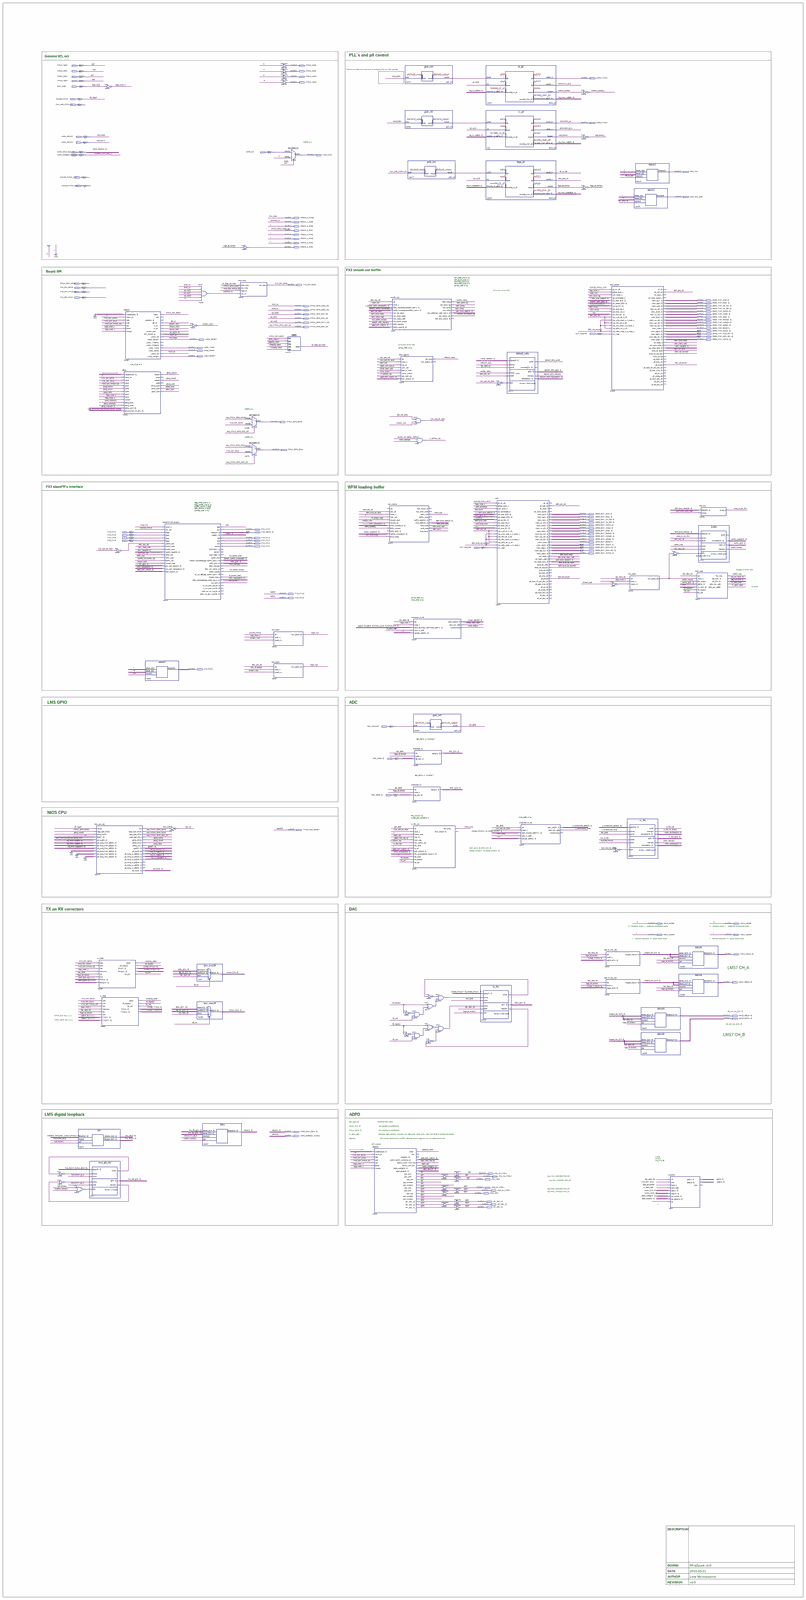
[diagram p0: schematic sheet, whole]
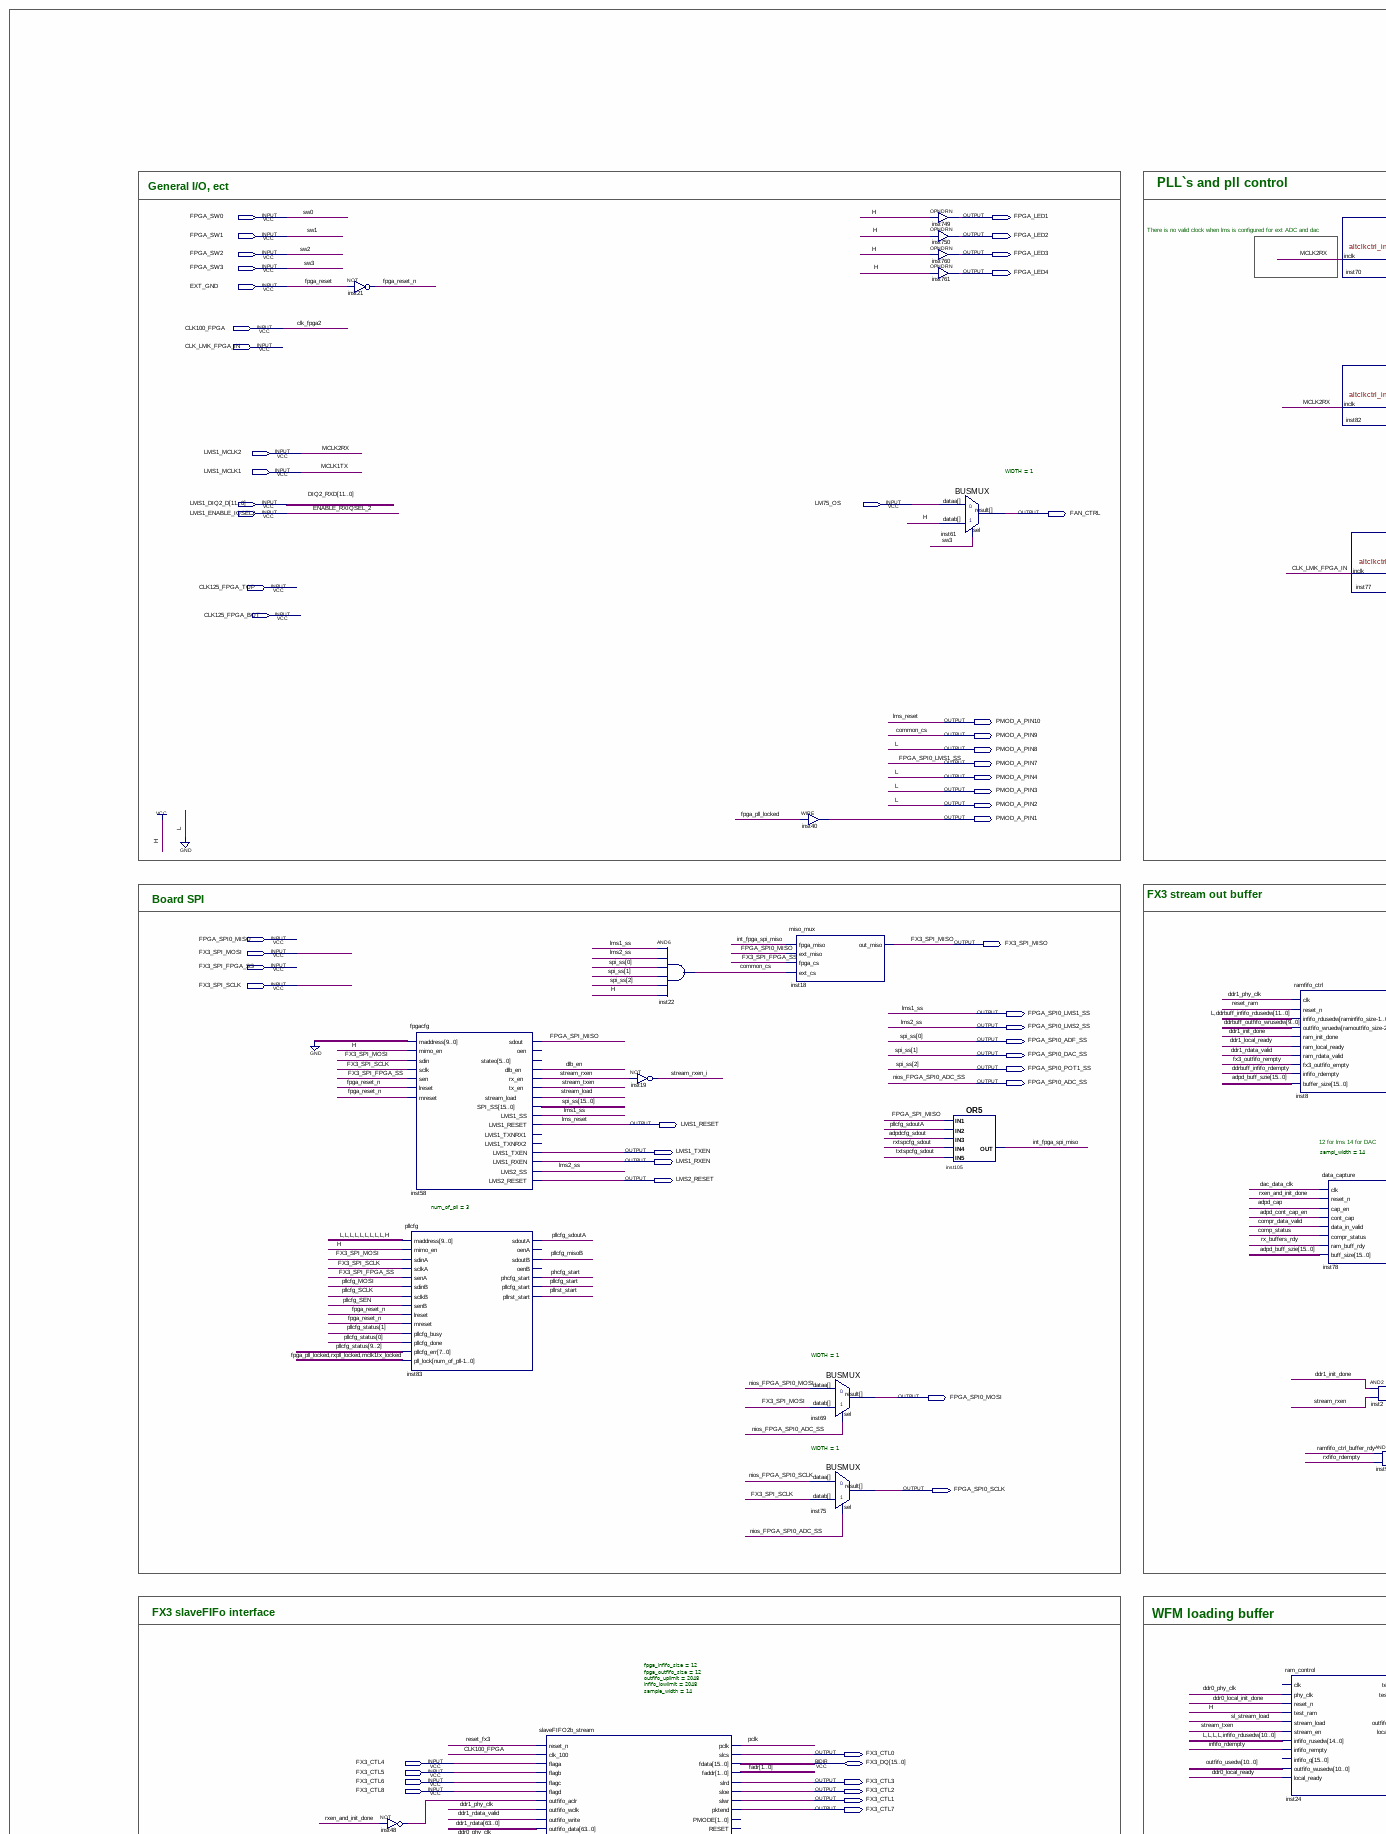
[diagram p1: schematic sheet, upper left part]
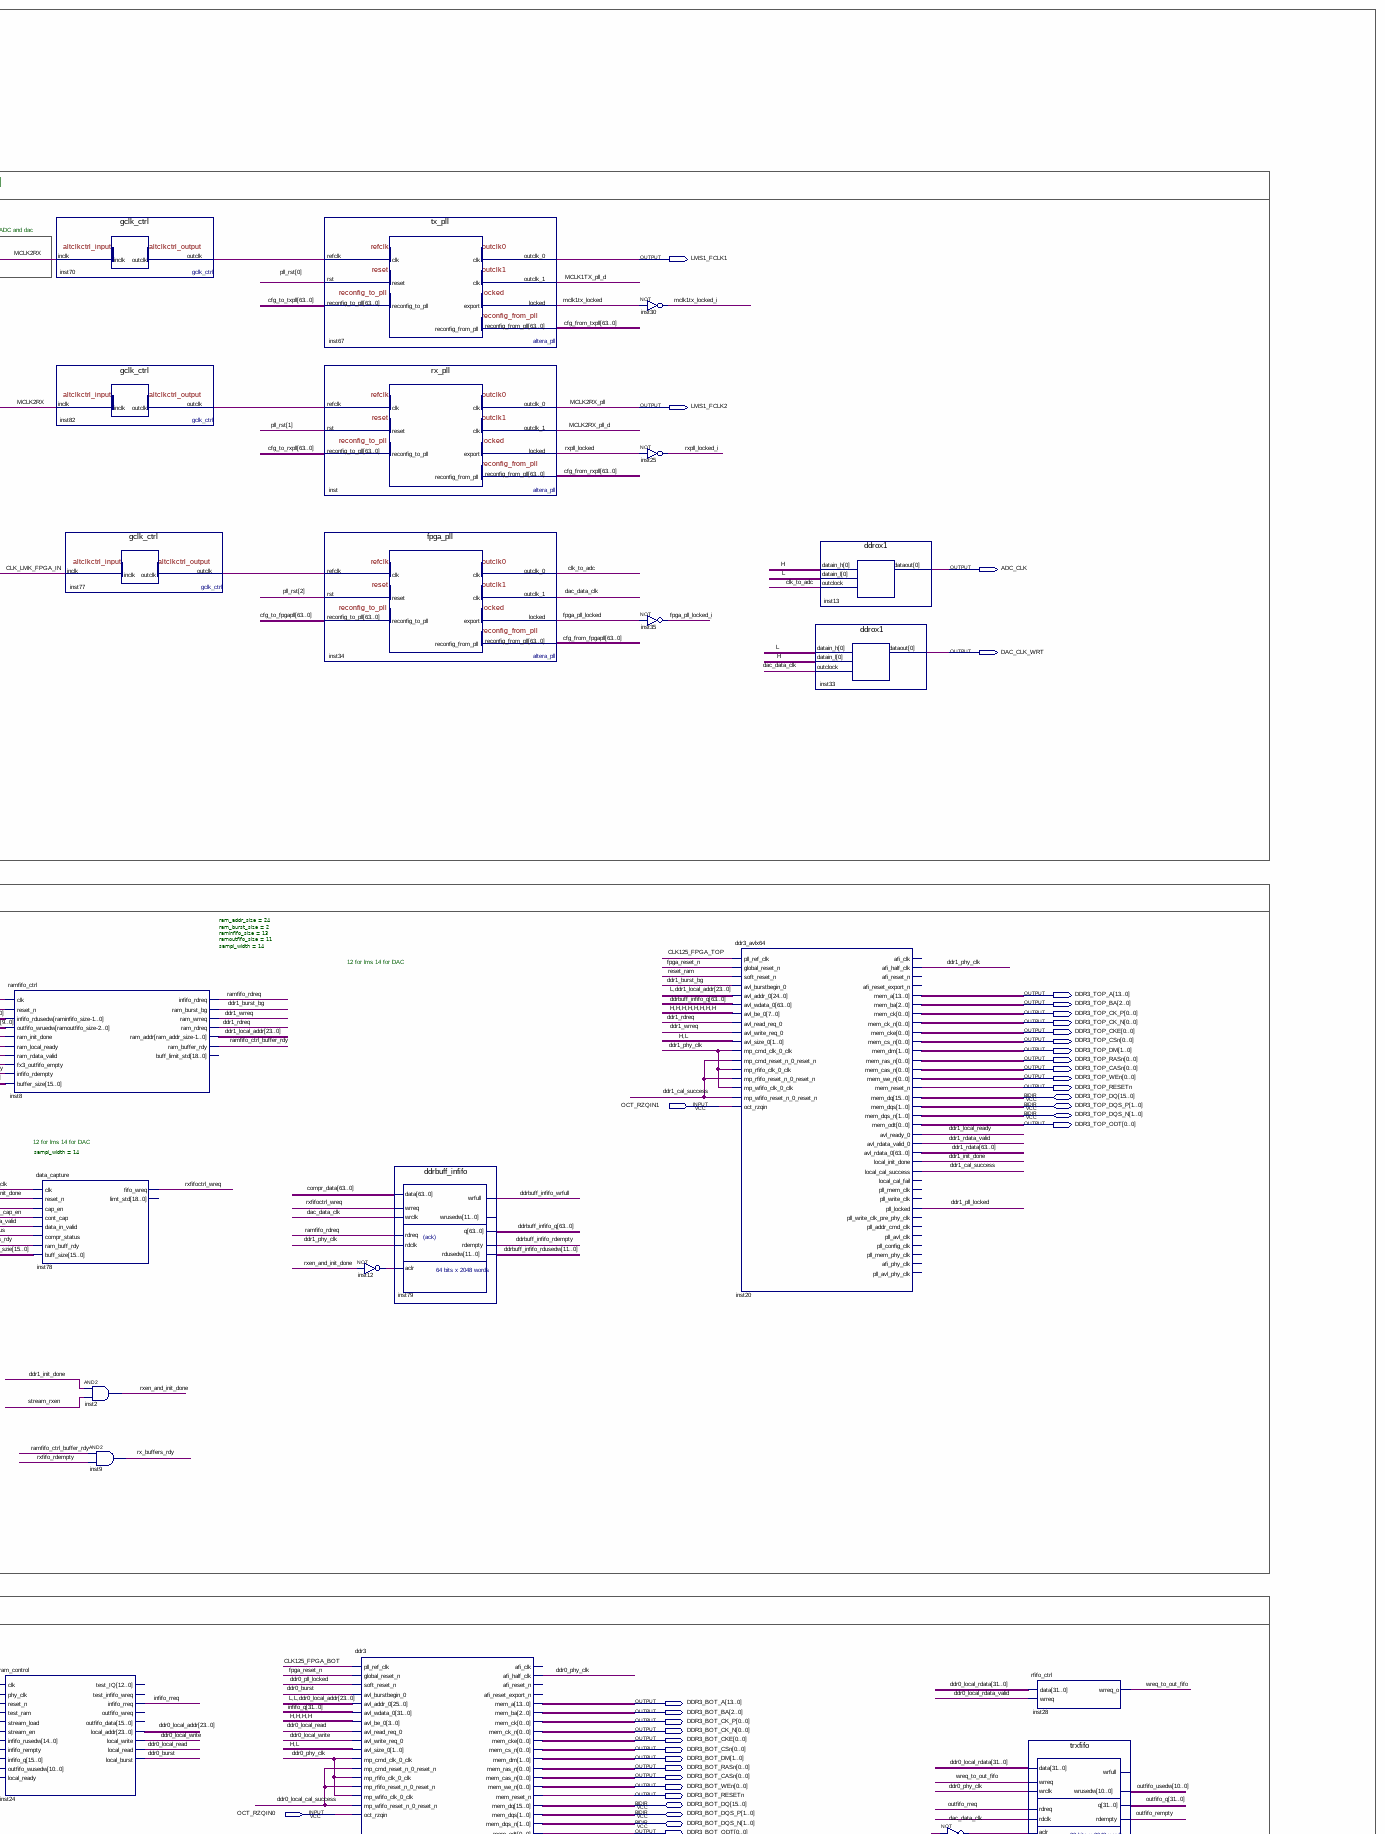
[diagram p2: schematic sheet, upper right part]
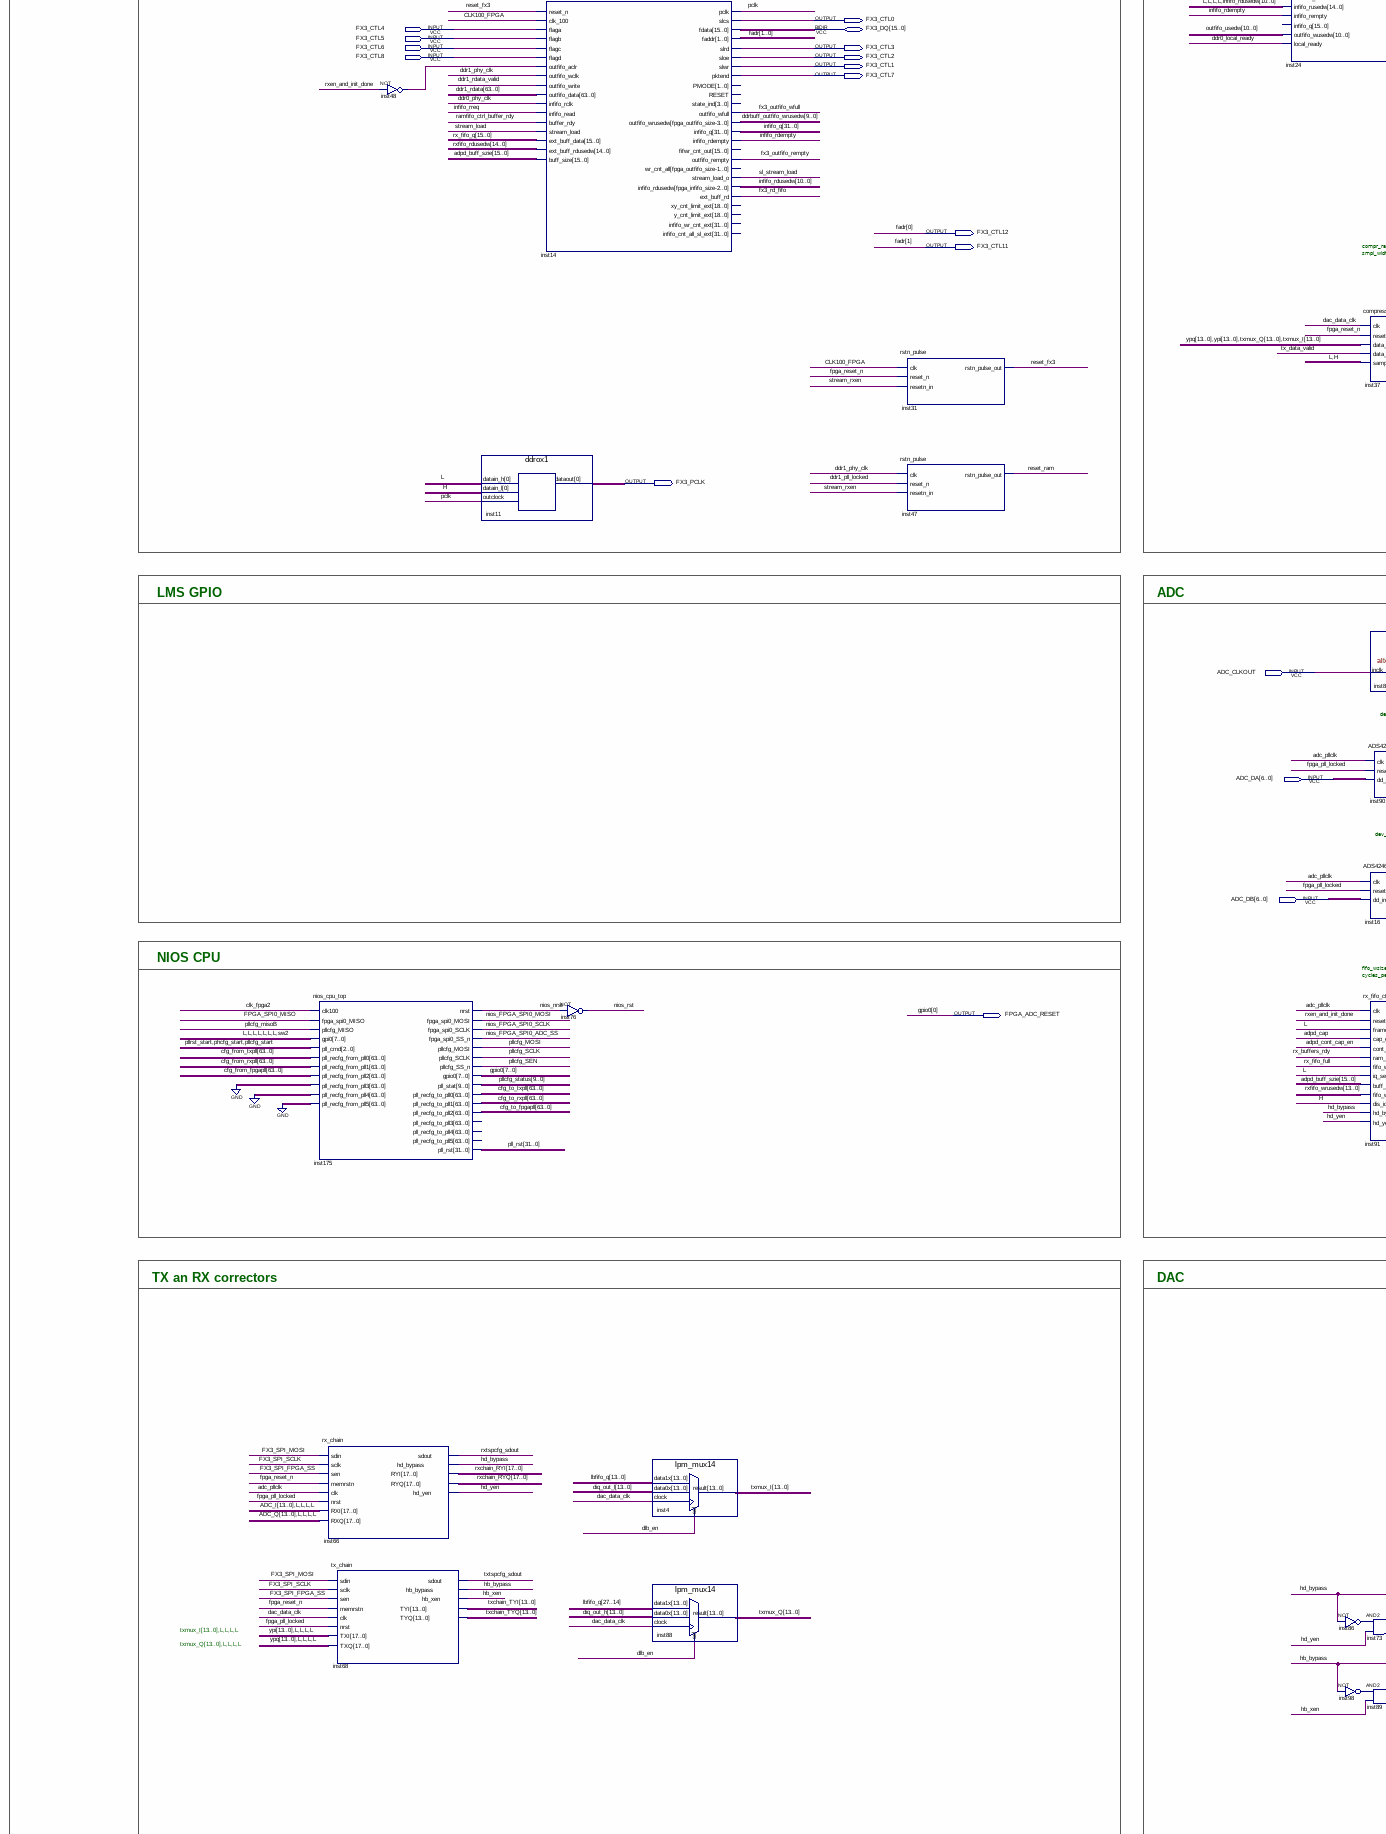
[diagram p3: schematic sheet, middle left part]
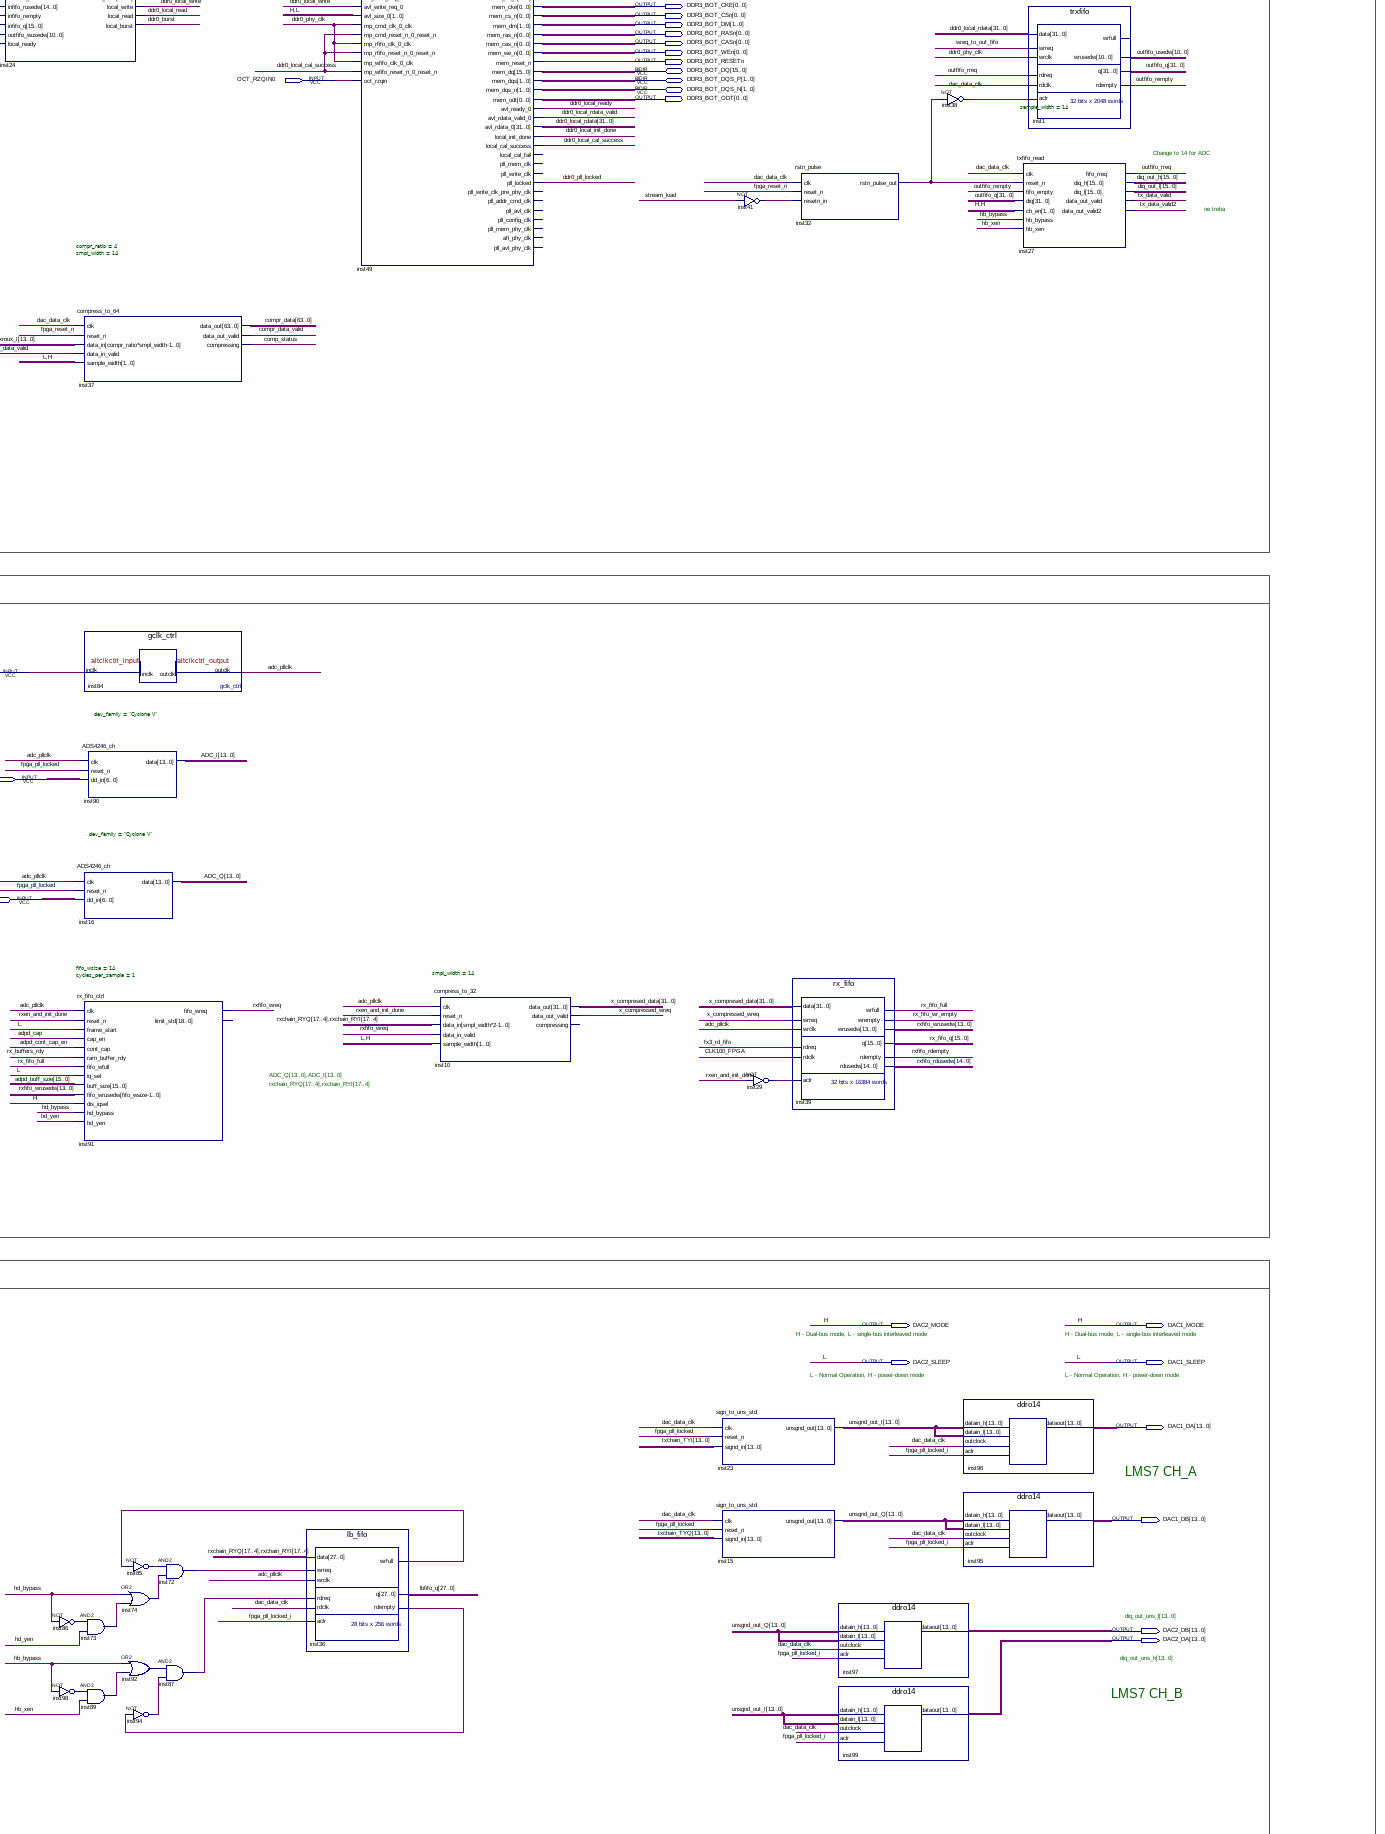
[diagram p4: schematic sheet, middle right part]
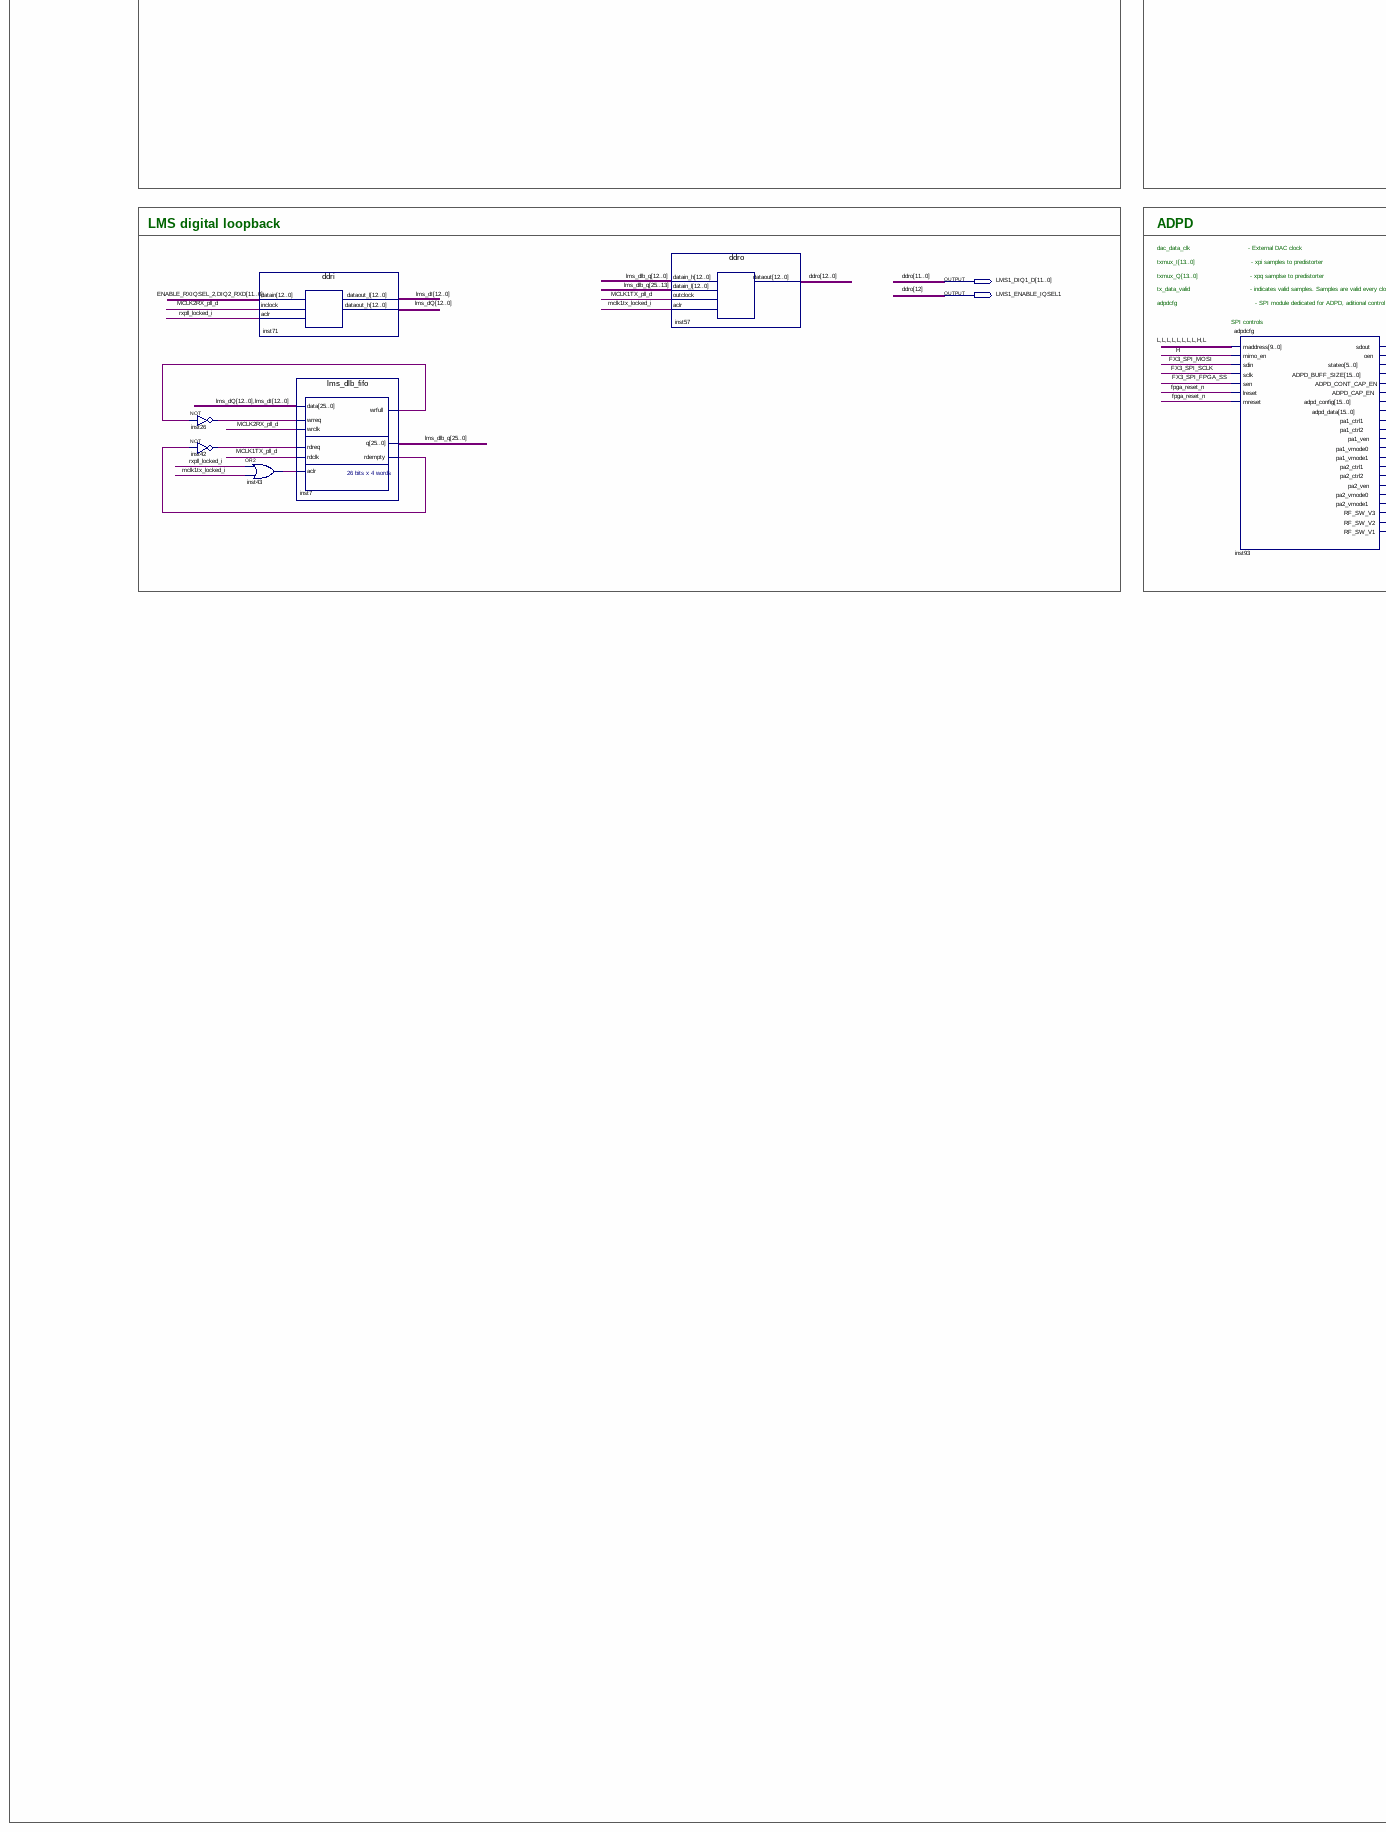
[diagram p5: schematic sheet, lower left part]
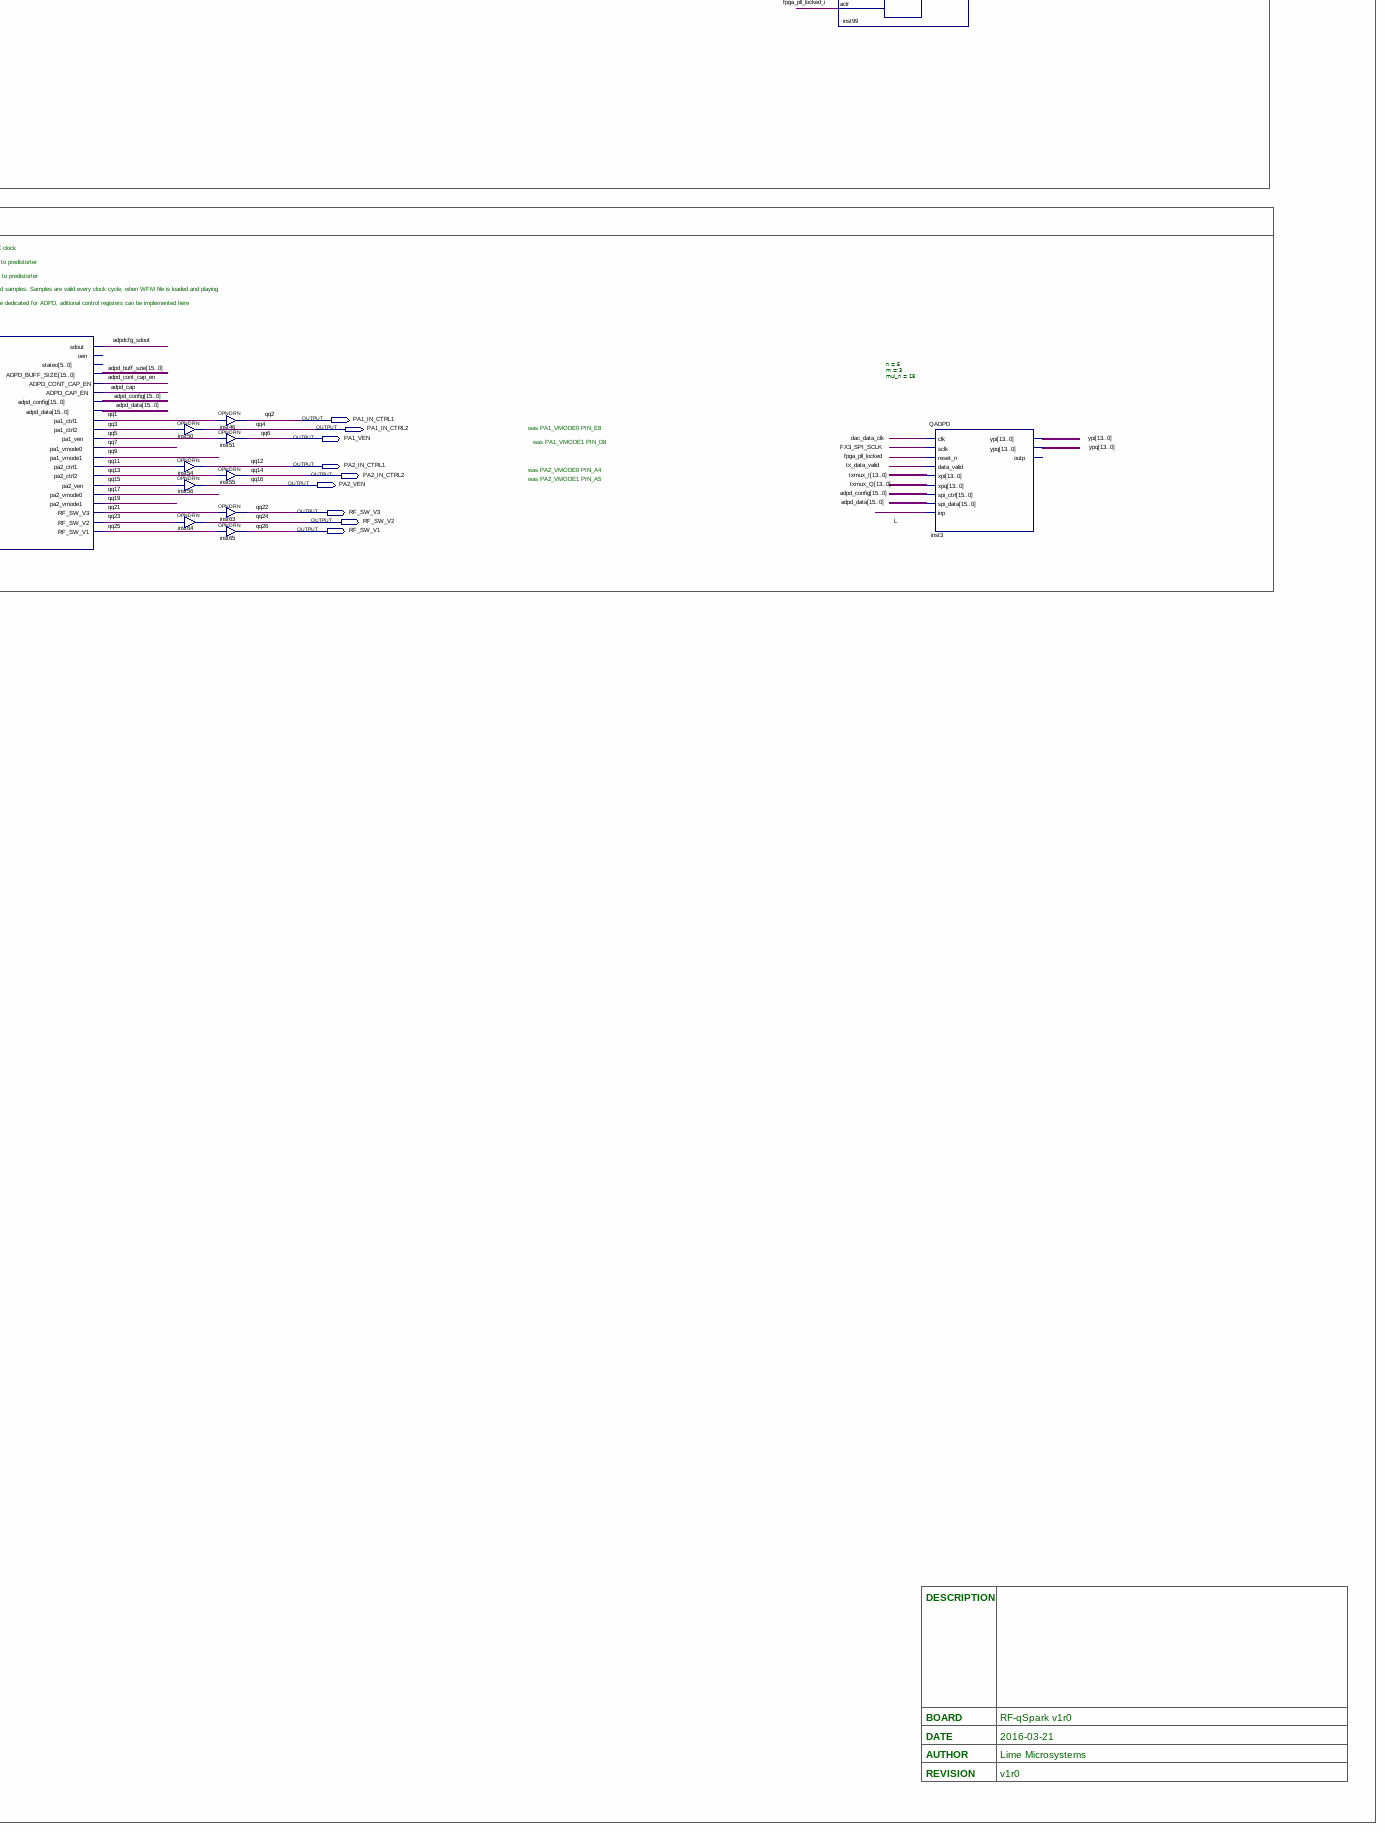
[diagram p6: schematic sheet, lower right part]
// Quartus schematic lms7_ADPD_top.bdf as structural Verilog: 94 symbols, 116 pins
module lms7_ADPD_top (
  input  FPGA_SW0,
  input  FPGA_SW1,
  input  FPGA_SW2,
  input  FPGA_SW3,
  input  EXT_GND,
  input  CLK100_FPGA,
  input  CLK_LMK_FPGA_IN,
  input  LMS1_MCLK2,
  input  LMS1_MCLK1,
  input  [11:0] LMS1_DIQ2_D,
  input  LM75_OS,
  input  LMS1_ENABLE_IQSEL2,
  input  CLK125_FPGA_TOP,
  input  CLK125_FPGA_BOT,
  input  FPGA_SPI0_MISO,
  input  FX3_SPI_MOSI,
  input  FX3_SPI_FPGA_SS,
  input  FX3_SPI_SCLK,
  input  OCT_RZQIN1,
  input  FX3_CTL4,
  input  FX3_CTL5,
  input  FX3_CTL6,
  input  FX3_CTL8,
  input  OCT_RZQIN0,
  input  ADC_CLKOUT,
  input  [6:0] ADC_DA,
  input  [6:0] ADC_DB,
  inout  [15:0] DDR3_TOP_DQ,
  inout  [1:0] DDR3_TOP_DQS_P,
  inout  [1:0] DDR3_TOP_DQS_N,
  inout  [15:0] FX3_DQ,
  inout  [15:0] DDR3_BOT_DQ,
  inout  [1:0] DDR3_BOT_DQS_P,
  inout  [1:0] DDR3_BOT_DQS_N,
  output FPGA_LED1,
  output FPGA_LED2,
  output FPGA_LED3,
  output LMS1_FCLK1,
  output FPGA_LED4,
  output LMS1_FCLK2,
  output FAN_CTRL,
  output ADC_CLK,
  output DAC_CLK_WRT,
  output PMOD_A_PIN10,
  output PMOD_A_PIN9,
  output PMOD_A_PIN8,
  output PMOD_A_PIN7,
  output PMOD_A_PIN4,
  output PMOD_A_PIN3,
  output PMOD_A_PIN2,
  output PMOD_A_PIN1,
  output FX3_SPI_MISO,
  output [13:0] DDR3_TOP_A,
  output [2:0] DDR3_TOP_BA,
  output FPGA_SPI0_LMS1_SS,
  output [0:0] DDR3_TOP_CK_P,
  output [0:0] DDR3_TOP_CK_N,
  output FPGA_SPI0_LMS2_SS,
  output [0:0] DDR3_TOP_CKE,
  output FPGA_SPI0_ADF_SS,
  output [0:0] DDR3_TOP_CSn,
  output [1:0] DDR3_TOP_DM,
  output FPGA_SPI0_DAC_SS,
  output [0:0] DDR3_TOP_RASn,
  output FPGA_SPI0_POT1_SS,
  output [0:0] DDR3_TOP_CASn,
  output [0:0] DDR3_TOP_WEn,
  output FPGA_SPI0_ADC_SS,
  output DDR3_TOP_RESETn,
  output LMS1_RESET,
  output [0:0] DDR3_TOP_ODT,
  output LMS1_TXEN,
  output LMS1_RXEN,
  output LMS2_RESET,
  output FPGA_SPI0_MOSI,
  output FPGA_SPI0_SCLK,
  output [13:0] DDR3_BOT_A,
  output [2:0] DDR3_BOT_BA,
  output [0:0] DDR3_BOT_CK_P,
  output [0:0] DDR3_BOT_CK_N,
  output [0:0] DDR3_BOT_CKE,
  output [0:0] DDR3_BOT_CSn,
  output FX3_CTL0,
  output [1:0] DDR3_BOT_DM,
  output [0:0] DDR3_BOT_RASn,
  output [0:0] DDR3_BOT_CASn,
  output FX3_CTL3,
  output [0:0] DDR3_BOT_WEn,
  output FX3_CTL2,
  output DDR3_BOT_RESETn,
  output FX3_CTL1,
  output FX3_CTL7,
  output [0:0] DDR3_BOT_ODT,
  output FX3_CTL12,
  output FX3_CTL11,
  output FX3_PCLK,
  output FPGA_ADC_RESET,
  output DAC2_MODE,
  output DAC1_MODE,
  output DAC2_SLEEP,
  output DAC1_SLEEP,
  output [13:0] DAC1_DA,
  output [13:0] DAC1_DB,
  output [13:0] DAC2_DB,
  output [13:0] DAC2_DA,
  output [11:0] LMS1_DIQ1_D,
  output LMS1_ENABLE_IQSEL1,
  output PA1_IN_CTRL1,
  output PA1_IN_CTRL2,
  output PA1_VEN,
  output PA2_IN_CTRL1,
  output PA2_IN_CTRL2,
  output PA2_VEN,
  output RF_SW_V3,
  output RF_SW_V2,
  output RF_SW_V1
);

  wire adc_pllclk, adpd_cap, adpd_cont_cap_en, adpdcfg_sdout, clk_to_adc, comp_status, compr_data_valid,
       dac_data_clk, ddr0_burst, ddr0_local_cal_success, ddr0_local_init_done, ddr0_local_rdata_valid,
       ddr0_local_read, ddr0_local_ready, ddr0_local_write, ddr0_phy_clk, ddr0_pll_locked, ddr1_burst_bg,
       ddr1_cal_success, ddr1_init_done, ddr1_local_ready, ddr1_phy_clk, ddr1_pll_locked, ddr1_rdata_valid,
       ddr1_rdreq, ddr1_wrreq, ddrbuff_infifo_rdempty, ddrbuff_infifo_wrfull, dlb_en, fpga_pll_locked,
       fpga_pll_locked_i, fpga_reset_n, FPGA_SPI_MISO, fx3_outfifo_rempty, fx3_outfifo_wfull, fx3_rd_fifo,
       hb_bypass, hb_xen, hd_bypass, hd_yen, infifo_rdempty, infifo_rreq, inst7_rdempty, inst7_wrfull,
       inst12_out, inst26_out, inst29_out, inst32_rstn_pulse_out, inst36_rdempty, inst36_wrfull, inst38_out,
       inst41_out, inst42_out, inst43_out, inst48_out, inst70_outclk, inst72_out, inst73_out, inst74_out,
       inst77_outclk, inst82_outclk, inst85_out, inst86_out, inst87_out, inst89_out, inst92_out, inst94_out,
       inst98_out, int_fpga_spi_miso, mclk1tx_locked, mclk1tx_locked_i, MCLK1TX_pll_d, MCLK2RX_pll_d,
       nios_FPGA_SPI0_MOSI, nios_FPGA_SPI0_SCLK, nios_nrst, nios_rst, outfifo_rempty, outfifo_rreq, pclk,
       phcfg_start, pllcfg_misoB, pllcfg_MOSI, pllcfg_SCLK, pllcfg_sdoutA, pllcfg_SEN, pllcfg_start,
       pllrst_start, qq1, qq3, qq5, qq7, qq9, qq11, qq13, qq15, qq17, qq19, qq21, qq23, qq25,
       ramfifo_ctrl_buffer_rdy, ramfifo_rdreq, reset_fx3, reset_ram, rx_buffers_rdy, rx_fifo_full,
       rx_fifo_wr_empty, rxen_and_init_done, rxfifo_rdempty, rxfifo_wreq, rxfifoctrl_wreq, rxpll_locked,
       rxpll_locked_i, rxtspcfg_sdout, sl_stream_load, stream_load, stream_rxen, stream_rxen_i, stream_txen,
       tx_data_valid, tx_data_valid2, txtspcfg_sdout, wreq_to_out_fifo, x_compressed_wreq;
  wire [7:1] gpio0;
  wire [9:0] ddrbuff_outfifo_wrusedw, pllcfg_status;
  wire [10:0] infifo_rdusedw, outfifo_usedw;
  wire [11:0] ddrbuff_infifo_rdusedw;
  wire [12:0] lms_dI, lms_dQ;
  wire [13:0] ADC_I, ADC_Q, rxfifo_wrusedw, txchain_TYI, txchain_TYQ, txmux_I, txmux_Q, unsgnd_out_I,
       unsgnd_out_Q, ypi, ypq;
  wire [14:0] rxfifo_rdusedw;
  wire [15:0] adpd_buff_szie, adpd_config, adpd_data, diq_out_h, diq_out_l, rx_fifo_q;
  wire [15:3] spi_ss;
  wire [17:0] rxchain_RYI, rxchain_RYQ;
  wire [23:0] ddr0_local_addr, ddr1_local_addr;
  wire [25:0] lms_dlb_q;
  wire [27:0] lbfifo_q;
  wire [31:0] ddr0_local_rdata, infifo_q, outfifo_q, pll_rst, x_compresed_data;
  wire [63:0] cfg_from_fpgapll, cfg_from_rxpll, cfg_from_txpll, cfg_to_fpgapll, cfg_to_rxpll, cfg_to_txpll,
       compr_data, ddr1_rdata, ddrbuff_infifo_q;

  not inst26 (inst26_out, inst7_wrfull);
  not inst42 (inst42_out, inst7_rdempty);
  or inst43 (inst43_out, rxpll_locked_i, mclk1tx_locked_i);
  ddri inst71 (
    .datain({LMS1_ENABLE_IQSEL2, LMS1_DIQ2_D}), .inclock(MCLK2RX_pll_d), .aclr(rxpll_locked_i),
    .dataout_l(lms_dI), .dataout_h(lms_dQ));
  nios_cpu_top inst175 (
    .clk100(CLK100_FPGA), .fpga_spi0_MISO(FPGA_SPI0_MISO), .pllcfg_MISO(pllcfg_misoB),
    .gpi0({{7{1'b0}}, FPGA_SW2}), .pll_cmd({pllrst_start, phcfg_start, pllcfg_start}),
    .pll_recfg_from_pll0(cfg_from_txpll), .pll_recfg_from_pll1(cfg_from_rxpll),
    .pll_recfg_from_pll2(cfg_from_fpgapll), .pll_recfg_from_pll3({64{1'b0}}),
    .pll_recfg_from_pll4({64{1'b0}}), .pll_recfg_from_pll5({64{1'b0}}), .nrst(nios_nrst),
    .fpga_spi0_MOSI(nios_FPGA_SPI0_MOSI), .fpga_spi0_SCLK(nios_FPGA_SPI0_SCLK),
    .fpga_spi0_SS_n(FPGA_SPI0_ADC_SS), .pllcfg_MOSI(pllcfg_MOSI), .pllcfg_SCLK(pllcfg_SCLK),
    .pllcfg_SS_n(pllcfg_SEN), .gpio0({gpio0, FPGA_ADC_RESET}), .pll_stat(pllcfg_status),
    .pll_recfg_to_pll0(cfg_to_txpll), .pll_recfg_to_pll1(cfg_to_rxpll), .pll_recfg_to_pll2(cfg_to_fpgapll),
    .pll_rst(pll_rst));  // open: pll_recfg_to_pll3, pll_recfg_to_pll4, pll_recfg_to_pll5
  rx_chain inst66 (
    .sdin(FX3_SPI_MOSI), .sclk(FX3_SPI_SCLK), .sen(FX3_SPI_FPGA_SS), .memrstn(fpga_reset_n),
    .clk(adc_pllclk), .nrst(fpga_pll_locked), .RXI({ADC_I, 4'b0000}), .RXQ({ADC_Q, 4'b0000}),
    .sdout(rxtspcfg_sdout), .hd_bypass(hd_bypass), .RYI(rxchain_RYI), .RYQ(rxchain_RYQ), .hd_yen(hd_yen));
  lms_dlb_fifo inst7 (
    .data({lms_dQ, lms_dI}), .wrreq(inst26_out), .wrclk(MCLK2RX_pll_d), .rdreq(inst42_out),
    .rdclk(MCLK1TX_pll_d), .aclr(inst43_out), .wrfull(inst7_wrfull), .q(lms_dlb_q), .rdempty(inst7_rdempty));
  not inst21 (fpga_reset_n, EXT_GND);
  tx_chain inst68 (
    .sdin(FX3_SPI_MOSI), .sclk(FX3_SPI_SCLK), .sen(FX3_SPI_FPGA_SS), .memrstn(fpga_reset_n),
    .clk(dac_data_clk), .nrst(fpga_pll_locked), .TXI({ypi, 4'b0000}), .TXQ({ypq, 4'b0000}),
    .sdout(txtspcfg_sdout), .hb_bypass(hb_bypass), .hb_xen(hb_xen), .TYI(txchain_TYI), .TYQ(txchain_TYQ));
  not inst48 (inst48_out, rxen_and_init_done);
  fpgacfg inst58 (
    .maddress({10{1'b0}}), .mimo_en(1'b1), .sdin(FX3_SPI_MOSI), .sclk(FX3_SPI_SCLK), .sen(FX3_SPI_FPGA_SS),
    .lreset(fpga_reset_n), .mreset(fpga_reset_n), .sdout(FPGA_SPI_MISO), .dlb_en(dlb_en),
    .rx_en(stream_rxen), .tx_en(stream_txen), .stream_load(stream_load),
    .SPI_SS({spi_ss, FPGA_SPI0_POT1_SS, FPGA_SPI0_DAC_SS, FPGA_SPI0_ADF_SS}), .LMS1_SS(FPGA_SPI0_LMS1_SS),
    .LMS1_RESET(LMS1_RESET), .LMS1_TXEN(LMS1_TXEN), .LMS1_RXEN(LMS1_RXEN), .LMS2_SS(FPGA_SPI0_LMS2_SS),
    .LMS2_RESET(LMS2_RESET));  // open: oen, stateo, LMS1_TXNRX1, LMS1_TXNRX2
  pllcfg #(.num_of_pll(3)) inst83 (
    .maddress(10'b0000000001), .mimo_en(1'b1), .sdinA(FX3_SPI_MOSI), .sclkA(FX3_SPI_SCLK),
    .senA(FX3_SPI_FPGA_SS), .sdinB(pllcfg_MOSI), .sclkB(pllcfg_SCLK), .senB(pllcfg_SEN),
    .lreset(fpga_reset_n), .mreset(fpga_reset_n), .pllcfg_busy(pllcfg_status[1]),
    .pllcfg_done(pllcfg_status[0]), .pllcfg_err(pllcfg_status[9:2]),
    .pll_lock({fpga_pll_locked, rxpll_locked, mclk1tx_locked}), .sdoutA(pllcfg_sdoutA),
    .sdoutB(pllcfg_misoB), .phcfg_start(phcfg_start), .pllcfg_start(pllcfg_start), .pllrst_start(pllrst_start));  // open: oenA, oenB
  ddrox1 inst11 (.datain_h(1'b0), .datain_l(1'b1), .outclock(pclk), .dataout(FX3_PCLK));
  slaveFIFO2b_stream #(.fpga_infifo_size(12), .fpga_outfifo_size(12), .outfifo_uplimit(2048), .infifo_lowlimit(2048), .sample_width(14)) inst14 (
    .reset_n(reset_fx3), .clk_100(CLK100_FPGA), .flaga(FX3_CTL4), .flagb(FX3_CTL5), .flagc(FX3_CTL6),
    .flagd(FX3_CTL8), .outfifo_aclr(inst48_out), .outfifo_wclk(ddr1_phy_clk),
    .outfifo_write(ddr1_rdata_valid), .outfifo_data(ddr1_rdata), .infifo_rclk(ddr0_phy_clk),
    .infifo_read(infifo_rreq), .buffer_rdy(ramfifo_ctrl_buffer_rdy), .stream_load(stream_load),
    .ext_buff_data(rx_fifo_q), .ext_buff_rdusedw(rxfifo_rdusedw), .buff_size(adpd_buff_szie), .pclk(pclk),
    .slcs(FX3_CTL0), .faddr({FX3_CTL11, FX3_CTL12}), .slrd(FX3_CTL3), .sloe(FX3_CTL2), .slwr(FX3_CTL1),
    .pktend(FX3_CTL7), .outfifo_wfull(fx3_outfifo_wfull), .outfifo_wrusedw(ddrbuff_outfifo_wrusedw),
    .infifo_q(infifo_q), .infifo_rdempty(infifo_rdempty), .outfifo_rempty(fx3_outfifo_rempty),
    .stream_load_o(sl_stream_load), .infifo_rdusedw(infifo_rdusedw), .ext_buff_rd(fx3_rd_fifo), .fdata(FX3_DQ));  // open: PMODE, RESET, state_ind, fifwr_cnt_out, wr_cnt_all, xy_cnt_limit_ext, y_cnt_limit_ext, infifo_wr_cnt_ext, infifo_cnt_all_sl_ext
  not inst76 (nios_rst, nios_nrst);
  and inst22 (PMOD_A_PIN9, FPGA_SPI0_LMS1_SS, FPGA_SPI0_LMS2_SS, FPGA_SPI0_ADF_SS, FPGA_SPI0_DAC_SS, FPGA_SPI0_POT1_SS, 1'b1);
  not inst19 (stream_rxen_i, stream_rxen);
  lpm_mux14 inst4 (
    .data1x(lbfifo_q[13:0]), .data0x(diq_out_l[13:0]), .clock(dac_data_clk), .sel(dlb_en), .result(txmux_I));
  lpm_mux14 inst88 (
    .data1x(lbfifo_q[27:14]), .data0x(diq_out_h[13:0]), .clock(dac_data_clk), .sel(dlb_en), .result(txmux_Q));
  ddro inst57 (
    .datain_h(lms_dlb_q[12:0]), .datain_l(lms_dlb_q[25:13]), .outclock(MCLK1TX_pll_d),
    .aclr(mclk1tx_locked_i), .dataout({LMS1_ENABLE_IQSEL1, LMS1_DIQ1_D}));
  assign PMOD_A_PIN1 = fpga_pll_locked;  // WIRE inst40
  miso_mux inst18 (
    .fpga_miso(int_fpga_spi_miso), .ext_miso(FPGA_SPI0_MISO), .fpga_cs(FX3_SPI_FPGA_SS),
    .ext_cs(PMOD_A_PIN9), .out_miso(FX3_SPI_MISO));
  BUSMUX #(.WIDTH(1)) inst69 (
    .datab(FX3_SPI_MOSI), .sel(FPGA_SPI0_ADC_SS), .dataa(nios_FPGA_SPI0_MOSI), .result(FPGA_SPI0_MOSI));
  BUSMUX #(.WIDTH(1)) inst75 (
    .datab(FX3_SPI_SCLK), .sel(FPGA_SPI0_ADC_SS), .dataa(nios_FPGA_SPI0_SCLK), .result(FPGA_SPI0_SCLK));
  rstn_pulse inst31 (.clk(CLK100_FPGA), .reset_n(fpga_reset_n), .resetn_in(stream_rxen), .rstn_pulse_out(reset_fx3));
  rstn_pulse inst47 (
    .clk(ddr1_phy_clk), .reset_n(ddr1_pll_locked), .resetn_in(stream_rxen), .rstn_pulse_out(reset_ram));
  OPNDRN inst749 (.IN(1'b1), .OUT(FPGA_LED1));
  OPNDRN inst750 (.IN(1'b1), .OUT(FPGA_LED2));
  OPNDRN inst760 (.IN(1'b1), .OUT(FPGA_LED3));
  OPNDRN inst761 (.IN(1'b1), .OUT(FPGA_LED4));
  BUSMUX #(.WIDTH(1)) inst61 (.datab(1'b1), .sel(FPGA_SW3), .dataa(LM75_OS), .result(FAN_CTRL));
  or inst105 (int_fpga_spi_miso, FPGA_SPI_MISO, pllcfg_sdoutA, adpdcfg_sdout, rxtspcfg_sdout, txtspcfg_sdout);
  adpdcfg inst93 (
    .maddress(10'b0000000010), .mimo_en(1'b1), .sdin(FX3_SPI_MOSI), .sclk(FX3_SPI_SCLK),
    .sen(FX3_SPI_FPGA_SS), .lreset(fpga_reset_n), .mreset(fpga_reset_n), .sdout(adpdcfg_sdout),
    .ADPD_BUFF_SIZE(adpd_buff_szie), .ADPD_CONT_CAP_EN(adpd_cont_cap_en), .ADPD_CAP_EN(adpd_cap),
    .adpd_config(adpd_config), .adpd_data(adpd_data), .pa1_ctrl1(qq1), .pa1_ctrl2(qq3), .pa1_ven(qq5),
    .pa1_vmode0(qq7), .pa1_vmode1(qq9), .pa2_ctrl1(qq11), .pa2_ctrl2(qq13), .pa2_ven(qq15),
    .pa2_vmode0(qq17), .pa2_vmode1(qq19), .RF_SW_V3(qq21), .RF_SW_V2(qq23), .RF_SW_V1(qq25));  // open: oen, stateo
  ram_control inst24 (
    .phy_clk(ddr0_phy_clk), .reset_n(ddr0_local_init_done), .test_ram(1'b1), .stream_load(sl_stream_load),
    .stream_en(stream_txen), .infifo_rusedw({4'b0000, infifo_rdusedw}), .infifo_rempty(infifo_rdempty),
    .outfifo_wusedw(outfifo_usedw), .local_ready(ddr0_local_ready), .infifo_rreq(infifo_rreq),
    .local_addr(ddr0_local_addr), .local_write(ddr0_local_write), .local_read(ddr0_local_read),
    .local_burst(ddr0_burst));  // open: clk, infifo_q, test_IQ, test_infifo_wreq, outfifo_wreq, outfifo_data
  ramfifo_ctrl #(.ram_addr_size(24), .ram_burst_size(2), .raminfifo_size(13), .ramoutfifo_size(11), .sampl_width(14)) inst8 (
    .clk(ddr1_phy_clk), .reset_n(reset_ram), .infifo_rdusedw({1'b0, ddrbuff_infifo_rdusedw}),
    .outfifo_wruedw(ddrbuff_outfifo_wrusedw), .ram_init_done(ddr1_init_done),
    .ram_local_ready(ddr1_local_ready), .ram_rdata_valid(ddr1_rdata_valid),
    .fx3_outfifo_empty(fx3_outfifo_rempty), .infifo_rdempty(ddrbuff_infifo_rdempty),
    .buffer_size(adpd_buff_szie), .infifo_rdreq(ramfifo_rdreq), .ram_burst_bg(ddr1_burst_bg),
    .ram_wrreq(ddr1_wrreq), .ram_rdreq(ddr1_rdreq), .ram_addr(ddr1_local_addr),
    .ram_buffer_rdy(ramfifo_ctrl_buffer_rdy));  // open: buff_limit_std
  data_capture #(.sampl_width(14)) inst78 (
    .clk(dac_data_clk), .reset_n(rxen_and_init_done), .cap_en(adpd_cap), .cont_cap(adpd_cont_cap_en),
    .data_in_valid(compr_data_valid), .compr_status(comp_status), .ram_buff_rdy(rx_buffers_rdy),
    .buff_size(adpd_buff_szie), .fifo_wreq(rxfifoctrl_wreq));  // open: limt_std
  gclk_ctrl inst70 (.inclk(LMS1_MCLK2), .outclk(inst70_outclk));
  gclk_ctrl inst82 (.inclk(LMS1_MCLK2), .outclk(inst82_outclk));
  gclk_ctrl inst77 (.inclk(CLK_LMK_FPGA_IN), .outclk(inst77_outclk));
  compress_to_64 #(.compr_ratio(4), .smpl_width(14)) inst37 (
    .clk(dac_data_clk), .reset_n(fpga_reset_n), .data_in({ypq, ypi, txmux_Q, txmux_I}),
    .data_in_valid(tx_data_valid), .sample_width(2'b01), .data_out(compr_data),
    .data_out_valid(compr_data_valid), .compressing(comp_status));
  ADS4246_ch #(.dev_family("Cyclone V")) inst16 (
    .clk(adc_pllclk), .reset_n(fpga_pll_locked), .dd_in(ADC_DB), .data(ADC_Q));
  rx_fifo_ctrl #(.fifo_wsize(14), .cycles_per_sample(1)) inst91 (
    .clk(adc_pllclk), .reset_n(rxen_and_init_done), .frame_start(1'b0), .cap_en(adpd_cap),
    .cont_cap(adpd_cont_cap_en), .ram_buffer_rdy(rx_buffers_rdy), .fifo_wfull(rx_fifo_full), .iq_sel(1'b0),
    .buff_size(adpd_buff_szie), .fifo_wrusedw(rxfifo_wrusedw), .dis_iqsel(1'b1), .hd_bypass(hd_bypass),
    .hd_yen(hd_yen), .fifo_wreq(rxfifo_wreq));  // open: limit_std
  not inst86 (inst86_out, hd_bypass);
  not inst98 (inst98_out, hb_bypass);
  and inst2 (rxen_and_init_done, ddr1_init_done, stream_rxen);
  and inst9 (rx_buffers_rdy, ramfifo_ctrl_buffer_rdy, rxfifo_rdempty);
  gclk_ctrl inst84 (.inclk(ADC_CLKOUT), .outclk(adc_pllclk));
  ADS4246_ch #(.dev_family("Cyclone V")) inst90 (
    .clk(adc_pllclk), .reset_n(fpga_pll_locked), .dd_in(ADC_DA), .data(ADC_I));
  and inst73 (inst73_out, inst86_out, hd_yen);
  and inst89 (inst89_out, inst98_out, hb_xen);
  not inst85 (inst85_out, inst36_wrfull);
  or inst74 (inst74_out, hd_bypass, inst73_out);
  or inst92 (inst92_out, hb_bypass, inst89_out);
  not inst94 (inst94_out, inst36_rdempty);
  and inst72 (inst72_out, inst85_out, inst74_out);
  and inst87 (inst87_out, inst92_out, inst94_out);
  OPNDRN inst50 (.IN(qq3), .OUT(PA1_IN_CTRL2));
  OPNDRN inst54 (.IN(qq11), .OUT(PA2_IN_CTRL1));
  OPNDRN inst56 (.IN(qq15), .OUT(PA2_VEN));
  OPNDRN inst64 (.IN(qq23), .OUT(RF_SW_V2));
  OPNDRN inst46 (.IN(qq1), .OUT(PA1_IN_CTRL1));
  OPNDRN inst51 (.IN(qq5), .OUT(PA1_VEN));
  OPNDRN inst55 (.IN(qq13), .OUT(PA2_IN_CTRL2));
  OPNDRN inst63 (.IN(qq21), .OUT(RF_SW_V3));
  OPNDRN inst65 (.IN(qq25), .OUT(RF_SW_V1));
  tx_pll inst67 (
    .refclk(inst70_outclk), .rst(pll_rst[0]), .reconfig_to_pll(cfg_to_txpll), .outclk_0(LMS1_FCLK1),
    .outclk_1(MCLK1TX_pll_d), .locked(mclk1tx_locked), .reconfig_from_pll(cfg_from_txpll));
  rx_pll inst (
    .refclk(inst82_outclk), .rst(pll_rst[1]), .reconfig_to_pll(cfg_to_rxpll), .outclk_0(LMS1_FCLK2),
    .outclk_1(MCLK2RX_pll_d), .locked(rxpll_locked), .reconfig_from_pll(cfg_from_rxpll));
  fpga_pll inst34 (
    .refclk(inst77_outclk), .rst(pll_rst[2]), .reconfig_to_pll(cfg_to_fpgapll), .outclk_0(clk_to_adc),
    .outclk_1(dac_data_clk), .locked(fpga_pll_locked), .reconfig_from_pll(cfg_from_fpgapll));
  lb_fifo inst36 (
    .data({rxchain_RYQ[17:4], rxchain_RYI[17:4]}), .wrreq(inst72_out), .wrclk(adc_pllclk),
    .rdreq(inst87_out), .rdclk(dac_data_clk), .aclr(fpga_pll_locked_i), .wrfull(inst36_wrfull), .q(lbfifo_q),
    .rdempty(inst36_rdempty));
  not inst12 (inst12_out, rxen_and_init_done);
  ddr3 inst49 (
    .pll_ref_clk(CLK125_FPGA_BOT), .global_reset_n(fpga_reset_n), .soft_reset_n(ddr0_pll_locked),
    .avl_burstbegin_0(ddr0_burst), .avl_addr_0({2'b00, ddr0_local_addr}), .avl_wdata_0(infifo_q),
    .avl_be_0(4'b1111), .avl_read_req_0(ddr0_local_read), .avl_write_req_0(ddr0_local_write),
    .avl_size_0(2'b10), .mp_cmd_clk_0_clk(ddr0_phy_clk), .mp_cmd_reset_n_0_reset_n(ddr0_local_cal_success),
    .mp_rfifo_clk_0_clk(ddr0_phy_clk), .mp_rfifo_reset_n_0_reset_n(ddr0_local_cal_success),
    .mp_wfifo_clk_0_clk(ddr0_phy_clk), .mp_wfifo_reset_n_0_reset_n(ddr0_local_cal_success),
    .oct_rzqin(OCT_RZQIN0), .afi_half_clk(ddr0_phy_clk), .mem_a(DDR3_BOT_A), .mem_ba(DDR3_BOT_BA),
    .mem_ck(DDR3_BOT_CK_P[0]), .mem_ck_n(DDR3_BOT_CK_N[0]), .mem_cke(DDR3_BOT_CKE[0]),
    .mem_cs_n(DDR3_BOT_CSn[0]), .mem_dm(DDR3_BOT_DM), .mem_ras_n(DDR3_BOT_RASn[0]),
    .mem_cas_n(DDR3_BOT_CASn[0]), .mem_we_n(DDR3_BOT_WEn[0]), .mem_reset_n(DDR3_BOT_RESETn),
    .mem_odt(DDR3_BOT_ODT[0]), .avl_ready_0(ddr0_local_ready), .avl_rdata_valid_0(ddr0_local_rdata_valid),
    .avl_rdata_0(ddr0_local_rdata), .local_init_done(ddr0_local_init_done),
    .local_cal_success(ddr0_local_cal_success), .pll_locked(ddr0_pll_locked), .mem_dq(DDR3_BOT_DQ),
    .mem_dqs(DDR3_BOT_DQS_P), .mem_dqs_n(DDR3_BOT_DQS_N));  // open: afi_clk, afi_reset_n, afi_reset_export_n, local_cal_fail, pll_mem_clk, pll_write_clk, pll_write_clk_pre_phy_clk, pll_addr_cmd_clk, pll_avl_clk, pll_config_clk, pll_mem_phy_clk, afi_phy_clk, pll_avl_phy_clk
  ddrbuff_infifo inst79 (
    .data(compr_data), .wrreq(rxfifoctrl_wreq), .wrclk(dac_data_clk), .rdreq(ramfifo_rdreq),
    .rdclk(ddr1_phy_clk), .aclr(inst12_out), .wrfull(ddrbuff_infifo_wrfull), .q(ddrbuff_infifo_q),
    .rdempty(ddrbuff_infifo_rdempty), .rdusedw(ddrbuff_infifo_rdusedw));  // open: wrusedw
  compress_to_32 #(.smpl_width(14)) inst10 (
    .clk(adc_pllclk), .reset_n(rxen_and_init_done), .data_in({rxchain_RYQ[17:4], rxchain_RYI[17:4]}),
    .data_in_valid(rxfifo_wreq), .sample_width(2'b01), .data_out(x_compresed_data),
    .data_out_valid(x_compressed_wreq));  // open: compressing
  not inst30 (mclk1tx_locked_i, mclk1tx_locked);
  not inst25 (rxpll_locked_i, rxpll_locked);
  not inst35 (fpga_pll_locked_i, fpga_pll_locked);
  ddr3_avlx64 inst20 (
    .pll_ref_clk(CLK125_FPGA_TOP), .global_reset_n(fpga_reset_n), .soft_reset_n(reset_ram),
    .avl_burstbegin_0(ddr1_burst_bg), .avl_addr_0({1'b0, ddr1_local_addr}), .avl_wdata_0(ddrbuff_infifo_q),
    .avl_be_0({8{1'b1}}), .avl_read_req_0(ddr1_rdreq), .avl_write_req_0(ddr1_wrreq), .avl_size_0(2'b10),
    .mp_cmd_clk_0_clk(ddr1_phy_clk), .mp_cmd_reset_n_0_reset_n(ddr1_cal_success),
    .mp_rfifo_clk_0_clk(ddr1_phy_clk), .mp_rfifo_reset_n_0_reset_n(ddr1_cal_success),
    .mp_wfifo_clk_0_clk(ddr1_phy_clk), .mp_wfifo_reset_n_0_reset_n(ddr1_cal_success), .oct_rzqin(OCT_RZQIN1),
    .afi_half_clk(ddr1_phy_clk), .mem_a(DDR3_TOP_A), .mem_ba(DDR3_TOP_BA), .mem_ck(DDR3_TOP_CK_P[0]),
    .mem_ck_n(DDR3_TOP_CK_N[0]), .mem_cke(DDR3_TOP_CKE[0]), .mem_cs_n(DDR3_TOP_CSn[0]), .mem_dm(DDR3_TOP_DM),
    .mem_ras_n(DDR3_TOP_RASn[0]), .mem_cas_n(DDR3_TOP_CASn[0]), .mem_we_n(DDR3_TOP_WEn[0]),
    .mem_reset_n(DDR3_TOP_RESETn), .mem_odt(DDR3_TOP_ODT[0]), .avl_ready_0(ddr1_local_ready),
    .avl_rdata_valid_0(ddr1_rdata_valid), .avl_rdata_0(ddr1_rdata), .local_init_done(ddr1_init_done),
    .local_cal_success(ddr1_cal_success), .pll_locked(ddr1_pll_locked), .mem_dq(DDR3_TOP_DQ),
    .mem_dqs(DDR3_TOP_DQS_P), .mem_dqs_n(DDR3_TOP_DQS_N));  // open: afi_clk, afi_reset_n, afi_reset_export_n, local_cal_fail, pll_mem_clk, pll_write_clk, pll_write_clk_pre_phy_clk, pll_addr_cmd_clk, pll_avl_clk, pll_config_clk, pll_mem_phy_clk, afi_phy_clk, pll_avl_phy_clk
  not inst41 (inst41_out, stream_load);
  sign_to_uns_std inst23 (
    .clk(dac_data_clk), .reset_n(fpga_pll_locked), .signd_in(txchain_TYI), .unsgnd_out(unsgnd_out_I));
  sign_to_uns_std inst15 (
    .clk(dac_data_clk), .reset_n(fpga_pll_locked), .signd_in(txchain_TYQ), .unsgnd_out(unsgnd_out_Q));
  not inst29 (inst29_out, rxen_and_init_done);
  ddrox1 inst33 (.datain_h(1'b0), .datain_l(1'b1), .outclock(dac_data_clk), .dataout(DAC_CLK_WRT));
  rstn_pulse inst32 (
    .clk(dac_data_clk), .reset_n(fpga_reset_n), .resetn_in(inst41_out), .rstn_pulse_out(inst32_rstn_pulse_out));
  rx_fifo inst39 (
    .data(x_compresed_data), .wrreq(x_compressed_wreq), .wrclk(adc_pllclk), .rdreq(fx3_rd_fifo),
    .rdclk(CLK100_FPGA), .aclr(inst29_out), .wrfull(rx_fifo_full), .wrempty(rx_fifo_wr_empty),
    .wrusedw(rxfifo_wrusedw), .q(rx_fifo_q), .rdempty(rxfifo_rdempty), .rdusedw(rxfifo_rdusedw));
  ddrox1 inst13 (.datain_h(1'b1), .datain_l(1'b0), .outclock(clk_to_adc), .dataout(ADC_CLK));
  ddro14 inst97 (
    .datain_h(unsgnd_out_Q), .datain_l(unsgnd_out_Q), .outclock(dac_data_clk), .aclr(fpga_pll_locked_i),
    .dataout(DAC2_DB));
  ddro14 inst99 (
    .datain_h(unsgnd_out_I), .datain_l(unsgnd_out_I), .outclock(dac_data_clk), .aclr(fpga_pll_locked_i),
    .dataout(DAC2_DA));
  QADPD #(.n(5), .m(3), .mul_n(18)) inst3 (
    .clk(dac_data_clk), .sclk(FX3_SPI_SCLK), .reset_n(fpga_pll_locked), .data_valid(tx_data_valid),
    .xpi(txmux_I), .xpq(txmux_Q), .spi_ctrl(adpd_config), .spi_data(adpd_data), .inp(1'b0), .ypi(ypi),
    .ypq(ypq));  // open: outp
  not inst38 (inst38_out, inst32_rstn_pulse_out);
  ddro14 inst96 (
    .datain_h(unsgnd_out_I), .datain_l(unsgnd_out_I), .outclock(dac_data_clk), .aclr(fpga_pll_locked_i),
    .dataout(DAC1_DA));
  ddro14 inst95 (
    .datain_h(unsgnd_out_Q), .datain_l(unsgnd_out_Q), .outclock(dac_data_clk), .aclr(fpga_pll_locked_i),
    .dataout(DAC1_DB));
  rfifo_ctrl inst28 (.data(ddr0_local_rdata), .wrreq(ddr0_local_rdata_valid), .wrreq_o(wreq_to_out_fifo));
  trxfifo inst1 (
    .data(ddr0_local_rdata), .wrreq(wreq_to_out_fifo), .wrclk(ddr0_phy_clk), .rdreq(outfifo_rreq),
    .rdclk(dac_data_clk), .aclr(inst38_out), .wrusedw(outfifo_usedw), .q(outfifo_q), .rdempty(outfifo_rempty));  // open: wrfull
  txfifo_read #(.sample_width(14)) inst27 (
    .clk(dac_data_clk), .reset_n(inst32_rstn_pulse_out), .fifo_empty(outfifo_rempty), .diq(outfifo_q),
    .ch_en(2'b11), .hb_bypass(hb_bypass), .hb_xen(hb_xen), .fifo_rreq(outfifo_rreq), .diq_h(diq_out_h),
    .diq_l(diq_out_l), .data_out_valid(tx_data_valid), .data_out_valid2(tx_data_valid2));

  assign DAC1_MODE = 1'b1;
  assign DAC1_SLEEP = 1'b0;
  assign DAC2_MODE = 1'b1;
  assign DAC2_SLEEP = 1'b0;
  assign PMOD_A_PIN2 = 1'b0;
  assign PMOD_A_PIN3 = 1'b0;
  assign PMOD_A_PIN4 = 1'b0;
  assign PMOD_A_PIN7 = FPGA_SPI0_LMS1_SS;
  assign PMOD_A_PIN8 = 1'b0;
  assign PMOD_A_PIN10 = LMS1_RESET;

  // Other names for the same wires on the sheet: clk_fpga2 = CLK100_FPGA; common_cs = PMOD_A_PIN9;
  //   ddro[12:0] = {LMS1_ENABLE_IQSEL1, LMS1_DIQ1_D}; DIQ2_RXD[11:0] = LMS1_DIQ2_D;
  //   ENABLE_RXIQSEL_2 = LMS1_ENABLE_IQSEL2; fadr[1:0] = {FX3_CTL11, FX3_CTL12}; fpga_reset = EXT_GND;
  //   gpio0[0] = FPGA_ADC_RESET; lms1_ss = FPGA_SPI0_LMS1_SS; lms2_ss = FPGA_SPI0_LMS2_SS; lms_reset = LMS1_RESET;
  //   MCLK1TX = LMS1_MCLK1; MCLK2RX = LMS1_MCLK2; MCLK2RX_pll = LMS1_FCLK2; nios_FPGA_SPI0_ADC_SS = FPGA_SPI0_ADC_SS;
  //   qq2 = PA1_IN_CTRL1; qq4 = PA1_IN_CTRL2; qq6 = PA1_VEN; qq12 = PA2_IN_CTRL1; qq14 = PA2_IN_CTRL2; qq16 = PA2_VEN;
  //   qq22 = RF_SW_V3; qq24 = RF_SW_V2; qq26 = RF_SW_V1;
  //   spi_ss[2:0] = {FPGA_SPI0_POT1_SS, FPGA_SPI0_DAC_SS, FPGA_SPI0_ADF_SS}; sw0 = FPGA_SW0; sw1 = FPGA_SW1;
  //   sw2 = FPGA_SW2; sw3 = FPGA_SW3

  // Notes on the sheet:
  //   PLL`s and pll control
  //   General I/O, ect
  //   There is no valid clock when lms is configured for ext ADC and dac
  //   FX3 stream out buffer
  //   Board SPI
  //   12 for lms 14 for DAC
  //   12 for lms 14 for DAC
  //   FX3 slaveFIFo interface
  //   WFM loading buffer
  //   Change to 14 for ADC
  //   ne treba
  //   LMS GPIO
  //   ADC
  //   NIOS CPU
  //   ADC_Q[13..0],ADC_I[13..0]
  //   rxchain_RYQ[17..4],rxchain_RYI[17..4]
  //   TX an RX correctors
  //   DAC
  //   H - Dual-bus mode, L - single-bus interleaved mode
  //   H - Dual-bus mode, L - single-bus interleaved mode
  //   L - Normal Operation, H - power-down mode
  //   L - Normal Operation, H - power-down mode
  //   LMS7 CH_A
  //   diq_out_uns_l[13..0]
  //   txmux_I[13..0],L,L,L,L
  //   txmux_Q[13..0],L,L,L,L
  //   diq_out_uns_h[13..0]
  //   LMS7 CH_B
  //   LMS digital loopback
  //   ADPD
  //   dac_data_clk                             - External DAC clock
  //   txmux_I[13..0]                            - xpi samples to predistorter
  //   txmux_Q[13..0]                          - xpq samplse to predistorter
  //   tx_data_valid                              - indicates valid samples. Samples are valid every clock cycle, when WFM file is loaded and playing
  //   adpdcfg                                       - SPI module dedicated for ADPD, aditional control registers can be implemented here
  //   SPI controls
  //   was PA1_VMODE0 PIN_E8
  //   was PA1_VMODE1 PIN_D8
  //   was PA2_VMODE0 PIN_A4
  //   was PA2_VMODE1 PIN_A5
  //   DESCRIPTION
  //   BOARD
  //   RF-qSpark v1r0
  //   DATE
  //   2016-03-21
  //   AUTHOR
  //   Lime Microsystems
  //   REVISION
  //   v1r0
endmodule
